# Altium schematic sheet 94330_SKYPULSE IOC_V1.3.SchDoc
size 595 x 420 mm; PageSetup: Record=PageOptions|CenterHorizontal=False|CenterVertical=False|PrintScale=0.49|XCorrection=1.00|YCorrection=1.00|PrintKind=2|BorderSize=5000000|LeftOffset=0|BottomOffset=0|Orientation=2|PaperLength=1000|PaperWidth=1000|Scale=100|PaperSource=7|PrintQuality=-3|MediaType=1|DitherType=10|PrintScaleMode=1|PaperKind= |PaperIndex=256
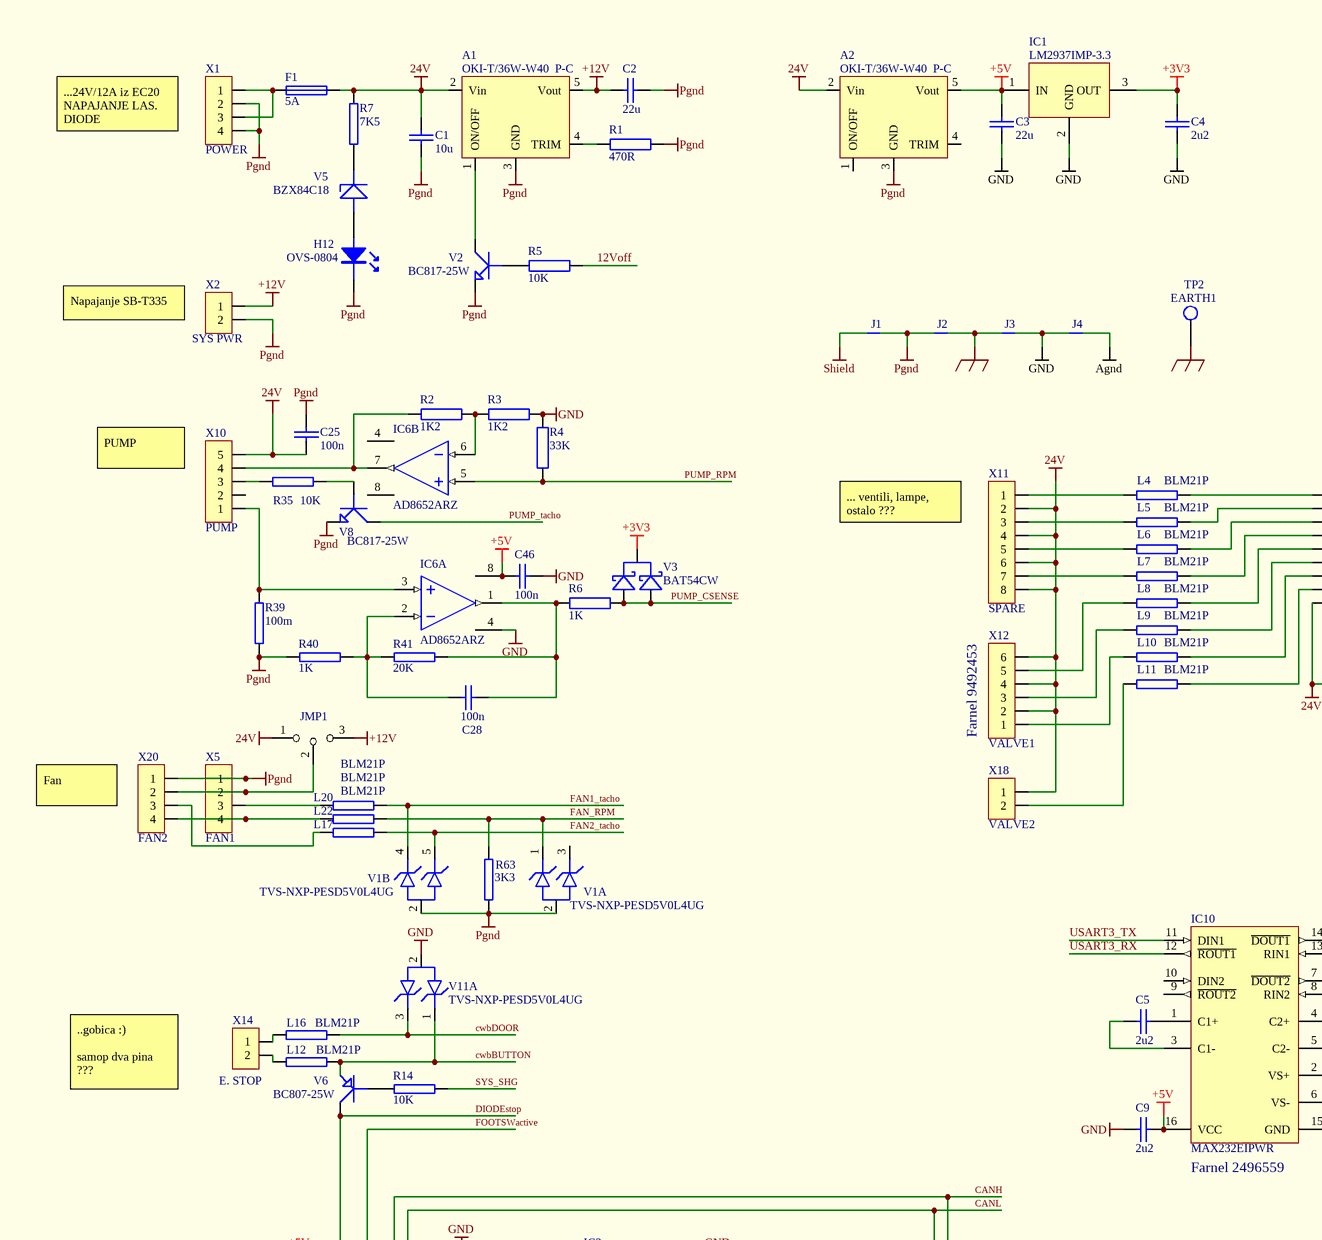
[diagram p0: 94330_SKYPULSE IOC_V1.3.SchDoc, top left]
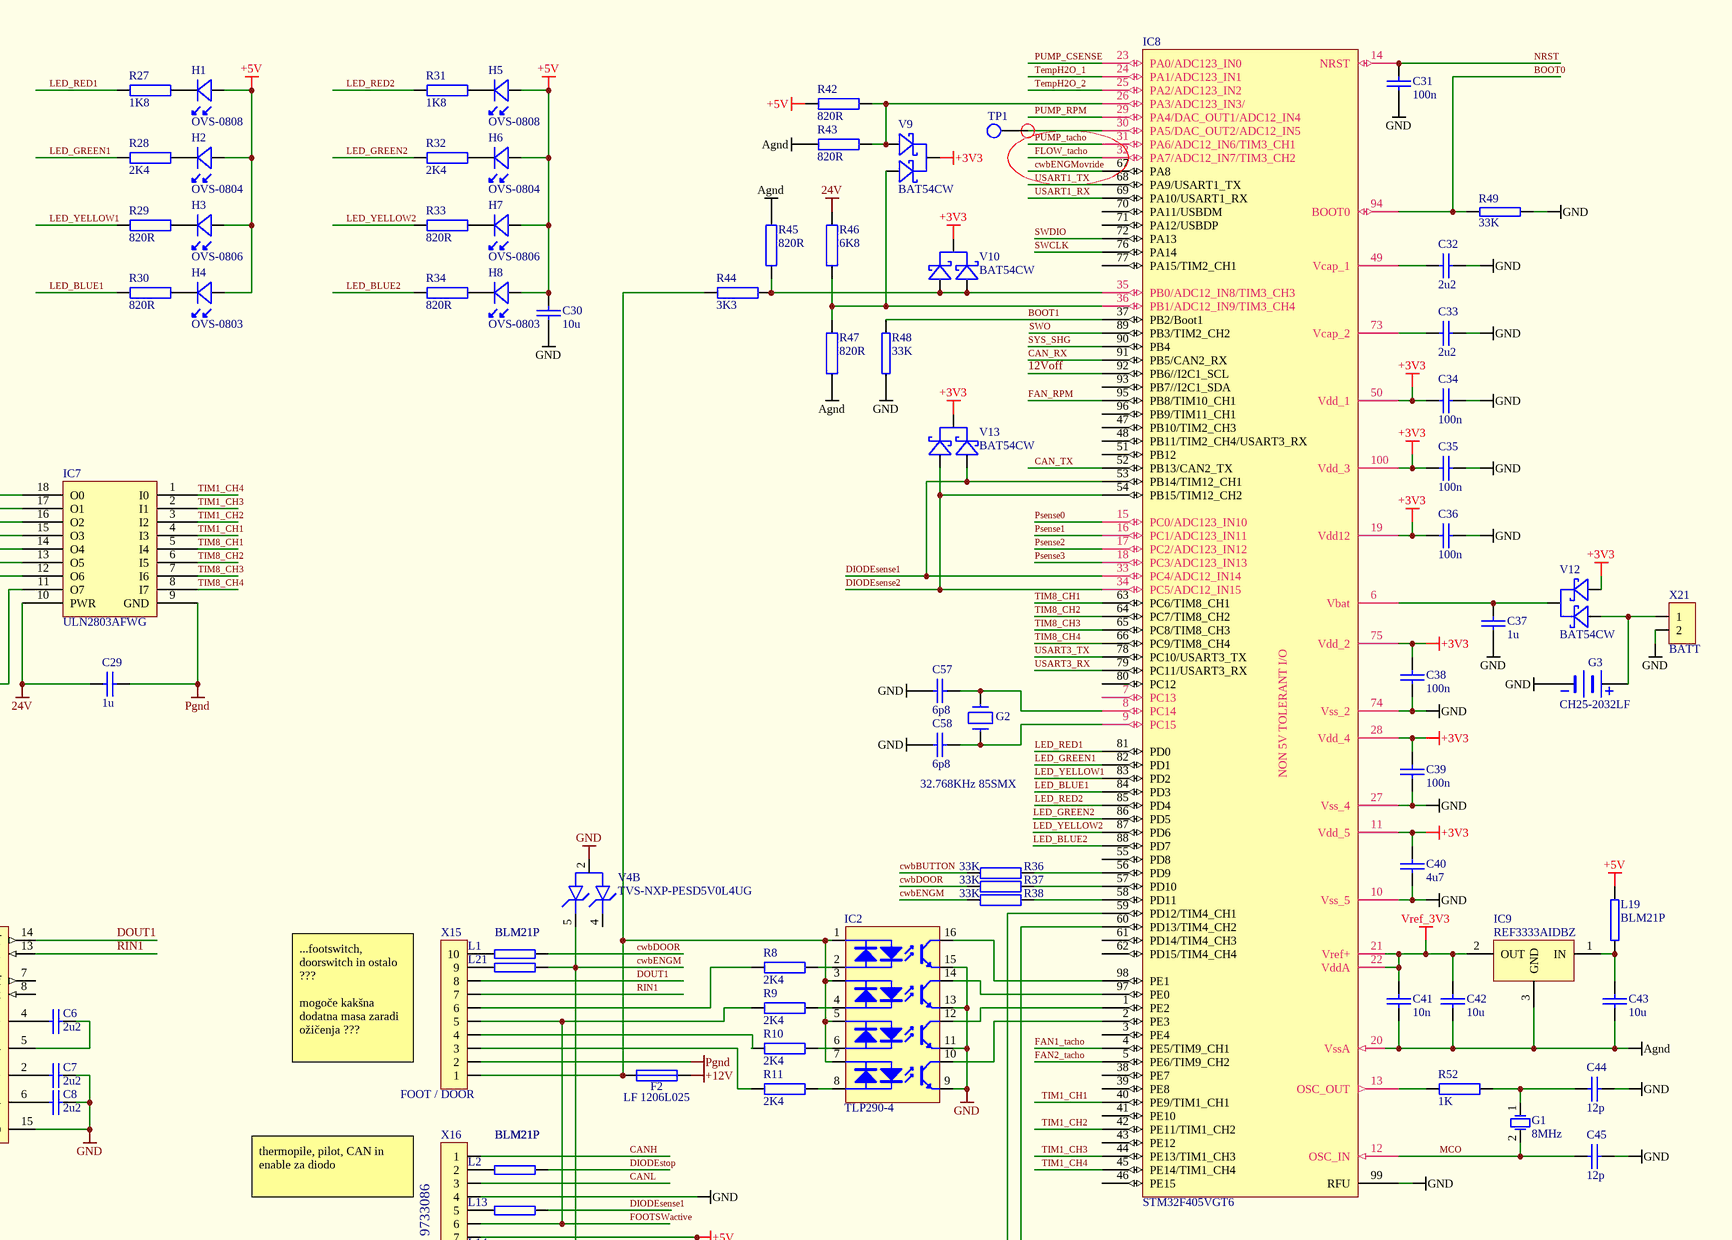
[diagram p1: 94330_SKYPULSE IOC_V1.3.SchDoc, top right]
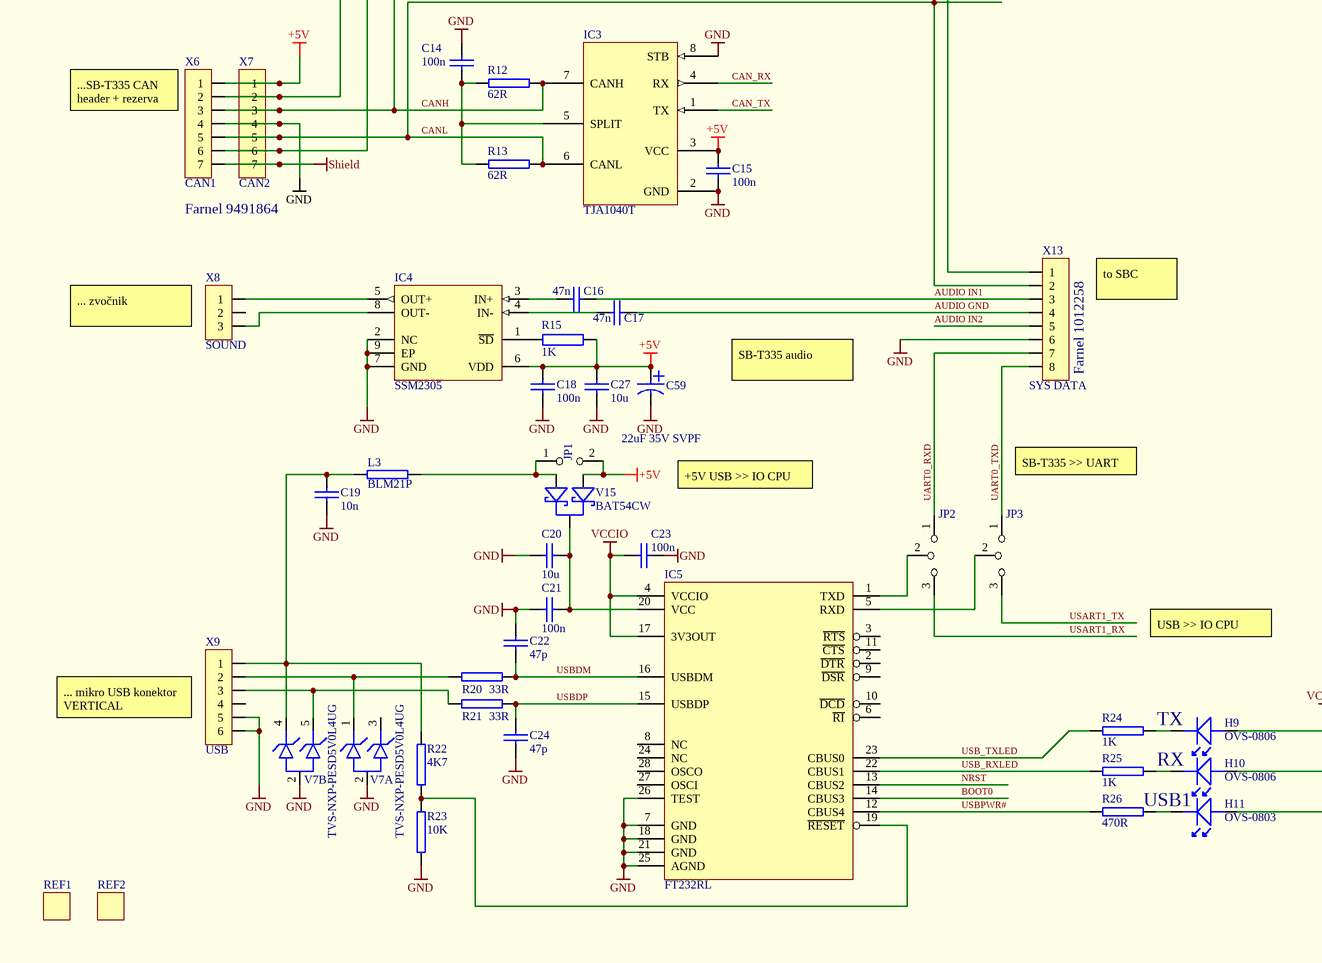
[diagram p2: 94330_SKYPULSE IOC_V1.3.SchDoc, bottom left]
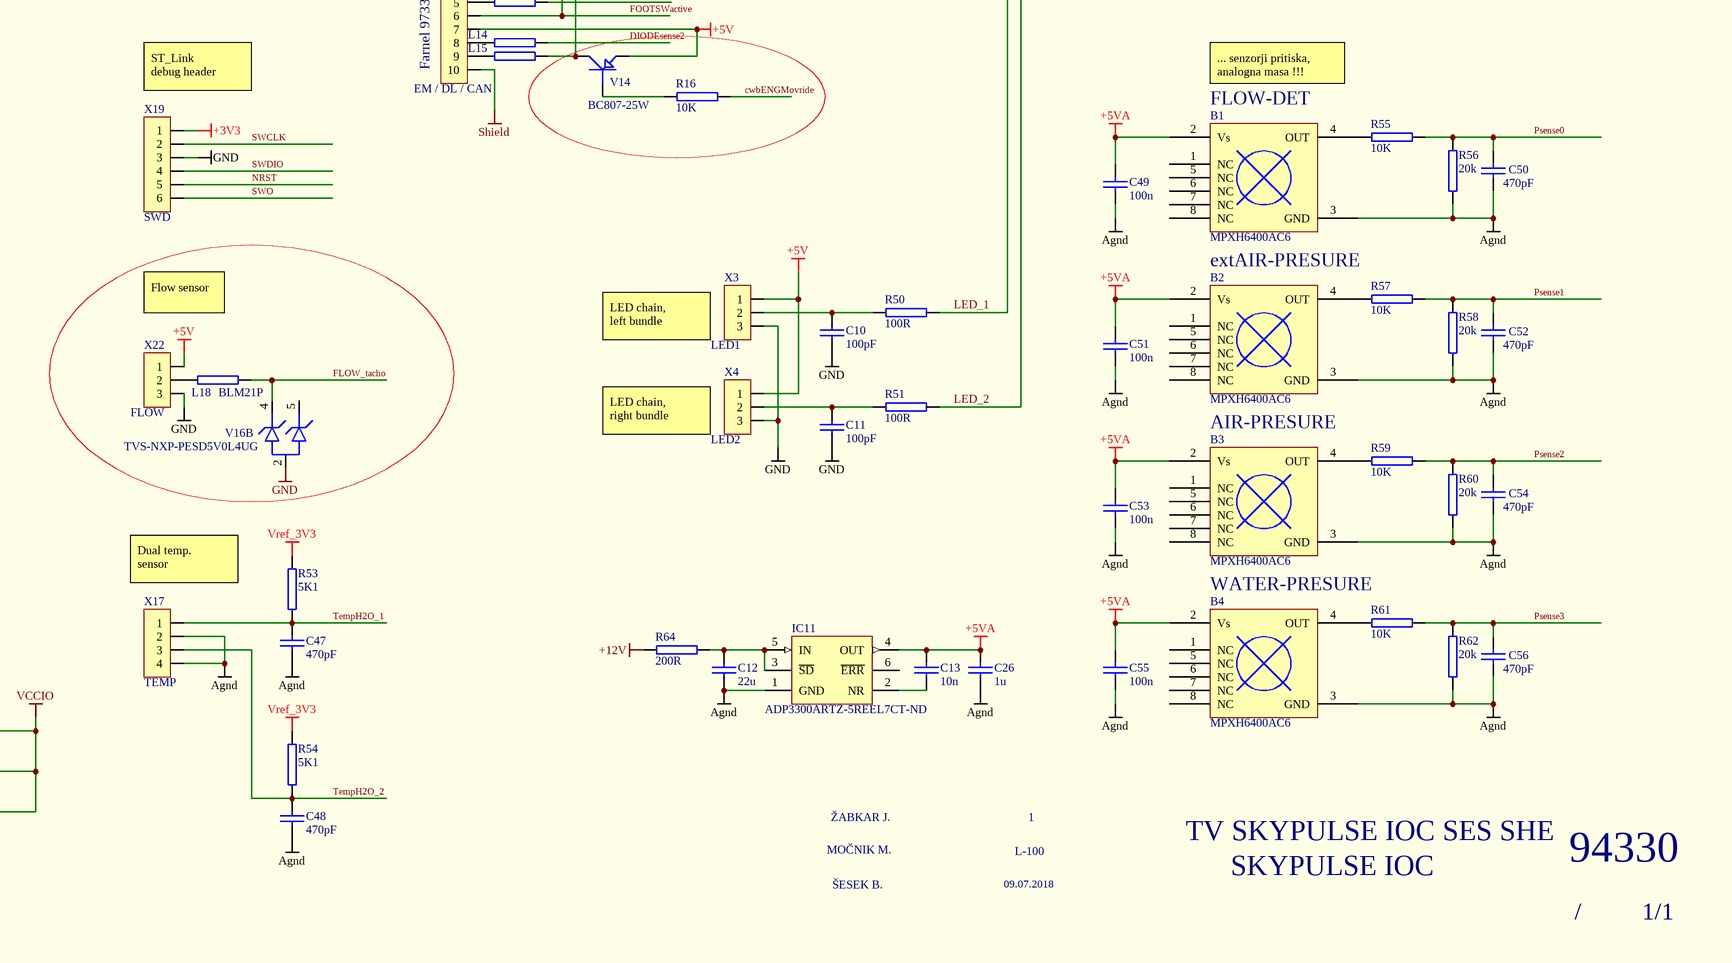
[diagram p3: 94330_SKYPULSE IOC_V1.3.SchDoc, bottom right]

## Parts
A1  OKI-T/36W-W40  P-C  [DC-DC_OKI-T/36W-W40]
A2  OKI-T/36W-W40  P-C  [DC-DC_OKI-T/36W-W40]
B1  MPXH6400AC6  [SOIC127P1030-8N_MPXH6400AC6]
B2  MPXH6400AC6  [SOIC127P1030-8N_MPXH6400AC6]
B3  MPXH6400AC6  [SOIC127P1030-8N_MPXH6400AC6]
B4  MPXH6400AC6  [SOIC127P1030-8N_MPXH6400AC6]
C1  10u  [CAPC3225N]
C2  22u  [CAPC3225N]
C3  22u  [CAPC3225N]
C4  2u2  [0805-C-IPC-V]
C5  2u2  [0805-C-IPC-V]
C6  2u2  [0805-C-IPC-V]
C7  2u2  [0805-C-IPC-V]
C8  2u2  [0805-C-IPC-V]
C9  2u2  [0805-C-IPC-V]
C10  100pF  [0805-C-IPC-V]
C11  100pF  [0805-C-IPC-V]
C12  22u  [CAPC3225N]
C13  10n  [0805-C-IPC-V]
C14  100n  [0805-C-IPC-V]
C15  100n  [0805-C-IPC-V]
C16  47n  [0805-C-IPC-V]
C17  47n  [0805-C-IPC-V]
C18  100n  [0805-C-IPC-V]
C19  10n  [0805-C-IPC-V]
C20  10u  [0805-C-IPC-V]
C21  100n  [0805-C-IPC-V]
C22  47p  [0805-C-V]
C23  100n  [0805-C-IPC-V]
C24  47p  [0805-C-V]
C25  100n  [0805-C-IPC-V]
C26  1u  [0805-C-IPC-V]
C27  10u  [0805-C-IPC-V]
C28  100n  [0805-C-IPC-V]
C29  1u  [0805-C-IPC-V]
C30  10u  [0805-C-IPC-V]
C31  100n  [0805-C-IPC-V]
C32  2u2  [0805-C-IPC-V]
C33  2u2  [0805-C-IPC-V]
C34  100n  [0805-C-IPC-V]
C35  100n  [0805-C-IPC-V]
C36  100n  [0805-C-IPC-V]
C37  1u  [0805-C-IPC-V]
C38  100n  [0805-C-IPC-V]
C39  100n  [0805-C-IPC-V]
C40  4u7  [0805-C-IPC-V]
C41  10n  [0805-C-IPC-V]
C42  10u  [0805-C-IPC-V]
C43  10u  [0805-C-IPC-V]
C44  12p  [0805-C-IPC-V]
C45  12p  [0805-C-IPC-V]
C46  100n  [0805-C-IPC-V]
C47  470pF  [0805-C-IPC-V]
C48  470pF  [0805-C-IPC-V]
C49  100n  [0805-C-IPC-V]
C50  470pF  [0805-C-IPC-V]
C51  100n  [0805-C-IPC-V]
C52  470pF  [0805-C-IPC-V]
C53  100n  [0805-C-IPC-V]
C54  470pF  [0805-C-IPC-V]
C55  100n  [0805-C-IPC-V]
C56  470pF  [0805-C-IPC-V]
C57  6p8  [0805-C-IPC-V]
C58  6p8  [0805-C-IPC-V]
C59  22uF 35V SVPF  [CAPAE66W54HN]
F1  5A  [FUSE_154_ LITTELFUSE]
F2  LF 1206L025  [FUSEC3216X09N]
G1  8MHz  [JXG53P2]
G2  32.768KHz 85SMX  [QUARTZ-85SMX]
G3  CH25-2032LF  [BATTERY HOLDER-20]
H1  OVS-0808  [LED_0805_RED]
H2  OVS-0804  [LED_0805_GREEN]
H3  OVS-0806  [LED_0805_YELLOW]
H4  OVS-0803  [LED_0805_BLUE]
H5  OVS-0808  [LED_0805_RED]
H6  OVS-0804  [LED_0805_GREEN]
H7  OVS-0806  [LED_0805_YELLOW]
H8  OVS-0803  [LED_0805_BLUE]
H9  OVS-0806  [LED_0805_YELLOW]
H10  OVS-0806  [LED_0805_YELLOW]
H11  OVS-0803  [LED_0805_BLUE]
H12  OVS-0804  [LED_0805_GREEN]
IC1  LM2937IMP-3.3  [SOT223-4N-V]
IC2  TLP290-4  [SOIC127P700X265-16N]
IC3  TJA1040T  [SO_8]
IC4  SSM2305  [SON50P300X85_HS-9N]
IC5  FT232RL  [SOP65P780-28N]
IC6  AD8652ARZ  [SOIC127P600-8N]  (parts A,B of 2)
IC7  ULN2803AFWG  [SOIC127P1030-18N]
IC8  STM32F405VGT6  [LQFP100_N]
IC9  REF3333AIDBZ  [SOT23-3N]
IC10  MAX232EIPWR  [TSOP65P640-16N]
IC11  ADP3300ARTZ-5REEL7CT-ND  [SOT23-6N]
J1  JMP-GND  [JMP-GND]  (value not drawn)
J2  JMP-GND  [JMP-GND]  (value not drawn)
J3  JMP-GND  [JMP-GND]  (value not drawn)
J4  JMP-GND  [JMP-GND]  (value not drawn)
JMP1  (no value)
JP1  (no value)  [SIP_2]
JP2  (no value)  [JMP3-SMD-1,2,3]
JP3  (no value)  [JMP3-SMD-1,2,3]
L1  BLM21P  [INDC2012N]
L2  BLM21P  [INDC2012N]
L3  BLM21P  [INDC2012N]
L4  BLM21P  [INDC2012N]
L5  BLM21P  [INDC2012N]
L6  BLM21P  [INDC2012N]
L7  BLM21P  [INDC2012N]
L8  BLM21P  [INDC2012N]
L9  BLM21P  [INDC2012N]
L10  BLM21P  [INDC2012N]
L11  BLM21P  [INDC2012N]
L12  BLM21P  [INDC2012N]
L13  BLM21P  [INDC2012N]
L14  BLM21P  [INDC2012N]
L15  BLM21P  [INDC2012N]
L16  BLM21P  [INDC2012N]
L17  BLM21P  [INDC2012N]
L18  BLM21P  [INDC2012N]
L19  BLM21P  [INDC2012N]
L20  BLM21P  [INDC2012N]
L21  BLM21P  [INDC2012N]
L22  BLM21P  [INDC2012N]
R1  470R  [0805-R-IPC-V]
R2  1K2  [0805-R-IPC-V]
R3  1K2  [0805-R-IPC-V]
R4  33K  [0805-R-V]
R5  10K  [0805-R-IPC-V]
R6  1K  [0805-R-IPC-V]
R7  7K5  [0805-R-IPC-V]
R8  2K4  [0805-R-IPC-V]
R9  2K4  [0805-R-IPC-V]
R10  2K4  [0805-R-IPC-V]
R11  2K4  [0805-R-IPC-V]
R12  62R  [0805-R-IPC-V]
R13  62R  [0805-R-IPC-V]
R14  10K  [0805-R-IPC-V]
R15  1K  [0805-R-IPC-V]
R16  10K  [0805-R-IPC-V]
R20  33R  [0805-R-IPC-V]
R21  33R  [0805-R-IPC-V]
R22  4K7  [0805-R-IPC-V]
R23  10K  [0805-R-IPC-V]
R24  1K  [0805-R-IPC-V]
R25  1K  [0805-R-IPC-V]
R26  470R  [0805-R-IPC-V]
R27  1K8  [0805-R-IPC-V]
R28  2K4  [0805-R-IPC-V]
R29  820R  [0805-R-IPC-V]
R30  820R  [0805-R-IPC-V]
R31  1K8  [0805-R-IPC-V]
R32  2K4  [0805-R-IPC-V]
R33  820R  [0805-R-IPC-V]
R34  820R  [0805-R-IPC-V]
R35  10K  [0805-R-IPC-V]
R36  33K  [0805-R-IPC-V]
R37  33K  [0805-R-IPC-V]
R38  33K  [0805-R-IPC-V]
R39  100m  [RESC3216N]
R40  1K  [0805-R-IPC-V]
R41  20K  [0805-R-IPC-V]
R42  820R  [0805-R-IPC-V]
R43  820R  [0805-R-IPC-V]
R44  3K3  [0805-R-IPC-V]
R45  820R  [0805-R-IPC-V]
R46  6K8  [0805-R-IPC-V]
R47  820R  [0805-R-IPC-V]
R48  33K  [0805-R-IPC-V]
R49  33K  [0805-R-IPC-V]
R50  100R  [0805-R-IPC-V]
R51  100R  [0805-R-IPC-V]
R52  1K  [0805-R-IPC-V]
R53  5K1  [0805-R-IPC-V]
R54  5K1  [0805-R-IPC-V]
R55  10K  [0805-R-IPC-V]
R56  20k  [0805-R-IPC-V]
R57  10K  [0805-R-IPC-V]
R58  20k  [0805-R-IPC-V]
R59  10K  [0805-R-IPC-V]
R60  20k  [0805-R-IPC-V]
R61  10K  [0805-R-IPC-V]
R62  20k  [0805-R-IPC-V]
R63  3K3  [0805-R-IPC-V]
R64  200R  [RESC3216N]
REF1  MEHAN_PART_1  [TP_REF]  (value not drawn)
REF2  (no value)  [TP_REF]
TP1  (no value)  [TP-09SQ]
TP2  EARTH1  [PAD]
V1  TVS-NXP-PESD5V0L4UG  [SC70-5]  (parts A,B of 2)
V2  BC817-25W  [SOT323-3N-CBE]
V3  BAT54CW  [SOT323-3N]
V4  TVS-NXP-PESD5V0L4UG  [SC70-5]  (part B of 2)
V5  BZX84C18  [SOT_23/D1]
V6  BC807-25W  [SOT323-3N-CBE]
V7  TVS-NXP-PESD5V0L4UG  [SC70-5]  (parts A,B of 2)
V8  BC817-25W  [SOT323-3N-CBE]
V9  BAT54CW  [SOT323-3N]
V10  BAT54CW  [SOT323-3N]
V11  TVS-NXP-PESD5V0L4UG  [SC70-5]  (part A of 2)
V12  BAT54CW  [SOT323-3N]
V13  BAT54CW  [SOT323-3N]
V14  BC807-25W  [SOT323-3N-CBE]
V15  BAT54CW  [SOT323-3N]
V16  TVS-NXP-PESD5V0L4UG  [SC70-5]  (part B of 2)
X1  POWER  [CON_4.2_4X_V]
X2  SYS PWR  [CON_3.0_2X_V_DUAL ROW]
X3  LED1  [CON-PH_3PIN_JST]
X4  LED2  [CON-PH_3PIN_JST]
X5  FAN1  [MOLEX_47053-1000]
X6  CAN1  [CON-PH_7PIN_JST]
X7  CAN2  [CON-PH_7PIN_JST]
X8  SOUND  [CON-MOLEX-53047-0310]
X9  USB  [CON_uUSB_TOP]
X10  PUMP  [CON-PH_5PIN_JST]
X11  SPARE  [CON-PH_8PIN_JST]
X12  VALVE1  [CON-PH_6PIN_JST]
X13  SYS DATA  [CON-MOLEX-53047-0810]
X14  E. STOP  [CON-PH_2PIN_JST]
X15  FOOT / DOOR  [CON-PH_10PIN_JST]
X16  EM / DL / CAN  [CON-MOLEX-53047-1010]
X17  TEMP  [CON-PH_4PIN_JST]
X18  VALVE2  [CON_3.0_2X_V_DUAL ROW]
X19  SWD  [CON-06-MALE-TH-2MM-VERTICAL]
X20  FAN2  [MOLEX_47053-1000]
X21  BATT  [CON-MOLEX-53047-0210]
X22  FLOW  [CON-PH_3PIN_JST]

## Nets
24V: A1.2(Vin) A2.2(Vin) C1.1 C25.1 C29.1 F1.2 IC7.10(PWR) JMP1.1 R7.2 R46.2 X10.5 X11.2 X11.4 X11.6 X11.8 X12.2 X12.4 X12.6 X18.1
+3V3: C4.2 C34.1 C35.1 C36.1 C38.2 C39.2 C40.2 IC1.3(OUT) IC8.11(Vdd_5) IC8.19(Vdd12) IC8.28(Vdd_4) IC8.50(Vdd_1) IC8.75(Vdd_2) IC8.100(Vdd_3) V3.3(K) V9.3(K) V10.3(K) V12.2(A2) V13.3(K) X19.1
+5V: A2.5(Vout) C3.2 C9.2 C15.2 C18.2 C27.1 C30.2 C46.1 C59.P H1.A H2.A H3.A H4.A H5.A H6.A H7.A H8.A IC1.1(IN) IC3.3(VCC) IC4.6(VDD) IC6.8(VCC) IC10.16(VCC) JP1.2 L19.2 R15.1 R42.1 V14.E V15.1(A1) X3.1 X4.1 X6.1 X7.1 X16.7 X22.1
+5VA: B1.2(Vs) B2.2(Vs) B3.2(Vs) B4.2(Vs) C13.1 C26.1 C49.1 C51.1 C53.1 C55.1 IC11.4(OUT)
+12V: A1.5(Vout) C2.2 F2.1 JMP1.3 R64.2 X2.1
Agnd: B1.3(GND) B2.3(GND) B3.3(GND) B4.3(GND) C12.2 C26.2 C41.2 C42.2 C43.2 C47.2 C48.2 C49.2 C50.2 C51.2 C52.2 C53.2 C54.2 C55.2 C56.2 IC8.20(VssA) IC9.3(GND) IC11.1(GND) J4.2 R43.1 R45.2 R47.1 R56.1 R58.1 R60.1 R62.1 X17.2 X17.4
EARTH: J2.2 J3.1 TP2.1
GND: C3.1 C4.1 C7.1 C8.1 C9.1 C10.2 C11.2 C14.1 C15.1 C18.1 C19.2 C20.2 C21.1 C22.1 C23.1 C24.2 C27.2 C30.1 C31.2 C32.2 C33.2 C34.2 C35.2 C36.2 C37.2 C38.1 C39.1 C40.1 C44.1 C45.1 C46.2 C57.2 C58.2 C59.M G3.M(-) IC1.2(GND) IC2.9(E) IC2.11(E) IC2.13(E) IC2.15(E) IC3.2(GND) IC3.8(STB) IC4.2(NC) IC4.7(GND) IC4.9(EP) IC5.7(GND) IC5.18(GND) IC5.21(GND) IC5.25(AGND) IC5.26(TEST) IC6.4(VEE) IC8.10(Vss_5) IC8.27(Vss_4) IC8.74(Vss_2) IC8.99(RFU) IC10.15(GND) J3.2 J4.1 R3.2 R4.1 R23.1 R48.1 R49.2 V4.2 V7.2 V11.2 V16.2 X3.3 X4.3 X6.4 X7.4 X9.5 X9.6 X13.6 X16.4 X19.3 X21.2 X22.3
Pgnd: A1.3(GND) A2.3(GND) C1.2 C2.1 C25.2 C29.2 H12.K IC7.9(GND) J1.2 J2.1 R1.2 R39.1 R40.1 R63.2 V1.2 V2.E V8.E X1.2 X1.4 X2.2 X5.1 X15.2 X20.1
Shield: J1.1 X6.7 X7.7 X16.10
VCCIO: C23.2 H9.A H10.A H11.A IC5.4(VCCIO) IC5.17(3V3OUT)
Vref_3V3: C41.1 C42.1 IC8.21(Vref+) IC8.22(VddA) IC9.2(OUT) R53.2 R54.2
12Voff: IC8.92(PB6//I2C1_SCL) R5.1
AUDIO GND: C17.2 X13.4
AUDIO IN1: C16.2 X13.3
AUDIO IN2: X13.5
BOOT0: IC5.14(CBUS3) IC8.94(BOOT0) R49.1
BOOT1: IC8.37(PB2/Boot1) R48.2
CAN_RX: IC3.4(RX) IC8.91(PB5/CAN2_RX)
CAN_TX: IC3.1(TX) IC8.52(PB13/CAN2_TX)
CANH: IC3.7(CANH) R12.1 X6.3 X7.3 X13.1 X16.1
CANL: IC3.6(CANL) R13.1 X6.5 X7.5 X13.2 X16.3
cwbBUTTON: L12.1 R36.1 V6.E V11.1
cwbDOOR: L1.1 L16.1 R37.1 V11.3
cwbENGM: L15.1 L21.1 R38.1 V4.5 V14.C
cwbENGMovride: IC8.67(PA8) R16.2
DIODEsense1: IC8.33(PC4/ADC12_IN14) IC8.53(PB14/TIM12_CH1) L13.1 V13.2(A2)
DIODEsense2: IC8.34(PC5/ADC12_IN15) IC8.54(PB15/TIM12_CH2) L14.1 V13.1(A1)
DIODEstop: L2.1 V6.C X6.2 X7.2
DOUT1: IC10.14(~{DOUT1}) X15.8
FAN1_tacho: IC8.4(PE5/TIM9_CH1) L20.1 V1.4
FAN2_tacho: IC8.5(PE6/TIM9_CH2) L17.1 V1.5
FAN_RPM: IC8.95(PB8/TIM10_CH1) L22.1 R63.1 V1.1
FLOW_tacho: IC8.32(PA7/ADC12_IN7/TIM3_CH2) L18.1 V16.4
FOOTSWactive: R9.1 X6.6 X7.6 X15.5 X16.6
LED_1: IC8.59(PD12/TIM4_CH1) R50.1
LED_2: IC8.60(PD13/TIM4_CH2) R51.1
LED_BLUE1: IC8.84(PD3) R30.1
LED_BLUE2: IC8.88(PD7) R34.1
LED_GREEN1: IC8.82(PD1) R28.1
LED_GREEN2: IC8.86(PD5) R32.1
LED_RED1: IC8.81(PD0) R27.1
LED_RED2: IC8.85(PD4) R31.1
LED_YELLOW1: IC8.83(PD2) R29.1
LED_YELLOW2: IC8.87(PD6) R33.1
MCO: C45.2 G1.2(OSC2) IC8.12(OSC_IN)
NRST: C31.1 IC5.13(CBUS2) IC8.14(NRST) X19.5
Psense0: C50.1 IC8.15(PC0/ADC123_IN10) R55.1 R56.2
Psense1: C52.1 IC8.16(PC1/ADC123_IN11) R57.1 R58.2
Psense2: C54.1 IC8.17(PC2/ADC123_IN12) R59.1 R60.2
Psense3: C56.1 IC8.18(PC3/ADC123_IN13) R61.1 R62.2
PUMP_CSENSE: IC8.23(PA0/ADC123_IN0) R6.2 V3.1(A1) V3.2(A2)
PUMP_RPM: IC6.5 IC8.29(PA4/DAC_OUT1/ADC12_IN4) R4.2
PUMP_tacho: IC8.31(PA6/ADC12_IN6/TIM3_CH1) V8.C
RIN1: IC10.13(RIN1) X15.7
SWCLK: IC8.76(PA14) X19.2
SWDIO: IC8.72(PA13) X19.4
SWO: IC8.89(PB3/TIM2_CH2) X19.6
SYS_SHG: IC8.90(PB4) R14.2
TempH2O_1: C47.1 IC8.24(PA1/ADC123_IN1) R53.1 X17.1
TempH2O_2: C48.1 IC8.25(PA2/ADC123_IN2) R54.1 X17.3
TIM1_CH1: IC7.4(I3) IC8.40(PE9/TIM1_CH1)
TIM1_CH2: IC7.3(I2) IC8.42(PE11/TIM1_CH2)
TIM1_CH3: IC7.2(I1) IC8.44(PE13/TIM1_CH3)
TIM1_CH4: IC7.1(I0) IC8.45(PE14/TIM1_CH4)
TIM8_CH1: IC7.5(I4) IC8.63(PC6/TIM8_CH1)
TIM8_CH2: IC7.6(I5) IC8.64(PC7/TIM8_CH2)
TIM8_CH3: IC7.7(I6) IC8.65(PC8/TIM8_CH3)
TIM8_CH4: IC7.8(I7) IC8.66(PC9/TIM8_CH4)
UART0_RXD: JP2.1 X13.7
UART0_TXD: JP3.1 X13.8
USART1_RX: IC8.69(PA10/USART1_RX) JP2.3
USART1_TX: IC8.68(PA9/USART1_TX) JP3.3
USART3_RX: IC8.79(PC11/USART3_RX) IC10.12(~{ROUT1})
USART3_TX: IC8.78(PC10/USART3_TX) IC10.11(DIN1)
USB_RXLED: IC5.22(CBUS1) R25.2
USB_TXLED: IC5.23(CBUS0) R24.2
USBDM: C22.2 IC5.16(USBDM) R20.1
USBDP: C24.1 IC5.15(USBDP) R21.1
USBPWR#: IC5.12(CBUS4) R26.2
NetA1_1: A1.1(ON/OFF) V2.C
NetA1_4: A1.4(TRIM) R1.1
NetB1_4: B1.4(OUT) R55.2
NetB2_4: B2.4(OUT) R57.2
NetB3_4: B3.4(OUT) R59.2
NetB4_4: B4.4(OUT) R61.2
NetC5_1: C5.1 IC10.1(C1+)
NetC5_2: C5.2 IC10.3(C1-)
NetC6_1: C6.1 IC10.5(C2-)
NetC6_2: C6.2 IC10.4(C2+)
NetC7_2: C7.2 IC10.2(VS+)
NetC8_2: C8.2 IC10.6(VS-)
NetC10_1: C10.1 R50.2 X3.2
NetC11_1: C11.1 R51.2 X4.2
NetC12_1: C12.1 IC11.3(~{SD}) IC11.5(IN) R64.1
NetC13_2: C13.2 IC11.2(NR)
NetC14_2: C14.2 IC3.5(SPLIT) R12.2 R13.2
NetC16_1: C16.1 IC4.3(IN+)
NetC17_1: C17.1 IC4.4(IN-)
NetC19_1: C19.1 L3.1 R22.1 V7.4 X9.1
NetC20_1: C20.1 C21.2 IC5.20(VCC) V15.3(K)
NetC28_1: C28.1 IC6.1 R6.1 R41.2
NetC28_2: C28.2 IC6.2 R40.2 R41.1
NetC32_1: C32.1 IC8.49(Vcap_1)
NetC33_1: C33.1 IC8.73(Vcap_2)
NetC37_1: C37.1 IC8.6(Vbat) V12.3(K)
NetC43_1: C43.1 IC9.1(IN) L19.1
NetC44_2: C44.2 G1.1(OSC1) R52.1
NetC57_1: C57.1 G2.1 IC8.8(PC14)
NetC58_1: C58.1 G2.2 IC8.9(PC15)
NetF1_1: F1.1 X1.1 X1.3
NetF2_2: F2.2 IC2.1(A) IC2.3(A) IC2.5(A) IC2.7(A) R44.2 X15.1
NetG3_P: G3.P(+) V12.1(A1) X21.1
NetH1_K: H1.K R27.2
NetH2_K: H2.K R28.2
NetH3_K: H3.K R29.2
NetH4_K: H4.K R30.2
NetH5_K: H5.K R31.2
NetH6_K: H6.K R32.2
NetH7_K: H7.K R33.2
NetH8_K: H8.K R34.2
NetH9_K: H9.K R24.1
NetH10_K: H10.K R25.1
NetH11_K: H11.K R26.1
NetH12_A: H12.A V5.A
NetIC2_2: IC2.2(K) R8.2
NetIC2_4: IC2.4(K) R9.2
NetIC2_6: IC2.6(K) R10.2
NetIC2_8: IC2.8(K) R11.2
NetIC2_10: IC2.10(C) IC8.2(PE3)
NetIC2_12: IC2.12(C) IC8.1(PE2)
NetIC2_14: IC2.14(C) IC8.97(PE0)
NetIC2_16: IC2.16(C) IC8.98(PE1)
NetIC4_1: IC4.1(~{SD}) R15.2
NetIC4_5: IC4.5(OUT+) X8.1
NetIC4_8: IC4.8(OUT-) X8.3
NetIC5_1: IC5.1(TXD) JP2.2
NetIC5_5: IC5.5(RXD) JP3.2
NetIC5_19: IC5.19(~{RESET}) R22.2 R23.2
NetIC6_3: IC6.3 R39.2 X10.1
NetIC6_6: IC6.6 R2.2 R3.1
NetIC6_7: IC6.7 R2.1 X10.4
NetIC7_11: IC7.11(O7) L11.1
NetIC7_12: IC7.12(O6) L10.1
NetIC7_13: IC7.13(O5) L9.1
NetIC7_14: IC7.14(O4) L8.1
NetIC7_15: IC7.15(O3) L7.1
NetIC7_16: IC7.16(O2) L6.1
NetIC7_17: IC7.17(O1) L5.1
NetIC7_18: IC7.18(O0) L4.1
NetIC8_13: IC8.13(OSC_OUT) R52.2
NetIC8_26: IC8.26(PA3/ADC123_IN3/) R42.2 R43.2 V9.2(A2)
NetIC8_30: IC8.30(PA5/DAC_OUT2/ADC12_IN5) TP1.1
NetIC8_35: IC8.35(PB0/ADC12_IN8/TIM3_CH3) R44.1 R45.1 V10.1(A1) V10.2(A2)
NetIC8_36: IC8.36(PB1/ADC12_IN9/TIM3_CH4) R46.1 R47.2 V9.1(A1)
NetIC8_56: IC8.56(PD9) R36.2
NetIC8_57: IC8.57(PD10) R37.2
NetIC8_58: IC8.58(PD11) R38.2
NetJMP1_2: JMP1.2 X5.2 X20.2
NetJP1_1: JP1.1 L3.2 V15.2(A2)
NetL1_2: L1.2 X15.10
NetL2_2: L2.2 X16.2
NetL4_2: L4.2 X11.1
NetL5_2: L5.2 X11.3
NetL6_2: L6.2 X11.5
NetL7_2: L7.2 X11.7
NetL8_2: L8.2 X12.5
NetL9_2: L9.2 X12.3
NetL10_2: L10.2 X12.1
NetL11_2: L11.2 X18.2
NetL12_2: L12.2 X14.2
NetL13_2: L13.2 X16.5
NetL14_2: L14.2 X16.8
NetL15_2: L15.2 X16.9
NetL16_2: L16.2 X14.1
NetL17_2: L17.2 X20.3
NetL18_2: L18.2 X22.2
NetL20_2: L20.2 X5.3
NetL21_2: L21.2 X15.9
NetL22_2: L22.2 X5.4 X20.4
NetR5_2: R5.2 V2.B
NetR7_1: R7.1 V5.K
NetR8_1: R8.1 X15.6
NetR10_1: R10.1 X15.4
NetR11_1: R11.1 X15.3
NetR14_1: R14.1 V6.B
NetR16_1: R16.1 V14.B
NetR20_2: R20.2 V7.1 X9.2
NetR21_2: R21.2 V7.5 X9.3
NetR35_1: R35.1 X10.3
NetR35_2: R35.2 V8.B

Not connected (* = marked no-connect by the designer): A2 1(ON/OFF) 4(TRIM); B1 1(NC) 5(NC) 6(NC) 7(NC) 8(NC); B2 1(NC) 5(NC) 6(NC) 7(NC) 8(NC); B3 1(NC) 5(NC) 6(NC) 7(NC) 8(NC); B4 1(NC) 5(NC) 6(NC) 7(NC) 8(NC); IC5 2(~{DTR}) 3(~{RTS}) 6(~{RI}) 8(NC) 9(~{DSR}) 10(~{DCD}) 11(~{CTS}) 24(NC) 27(OSCI) 28(OSCO); IC8 3(PE4) 7(PC13) 38(PE7) 39(PE8) 41(PE10) 43(PE12) 46(PE15) 47(PB10/TIM2_CH3) 48(PB11/TIM2_CH4/USART3_RX) 51(PB12) 55(PD8) 61(PD14/TIM4_CH3) 62(PD15/TIM4_CH4) 70(PA11/USBDM) 71(PA12/USBDP) 77(PA15/TIM2_CH1) 80(PC12) 93(PB7//I2C1_SDA) 96(PB9/TIM11_CH1); IC10 7(~{DOUT2}) 8(RIN2) 9(~{ROUT2}) 10(DIN2); IC11 6(~{ERR}); V1 3; V4 4; V7 3; V16 5; X8 2; X9 4; X10 2

## Notes on the sheet
- ...24V/12A iz EC20
  NAPAJANJE LAS. DIODE
- (near X2) Napajanje SB-T335
- (near X10) PUMP
- ... ventili, lampe, ostalo ???
- (near X12) Farnel 9492453
- (near X20) Fan
- ...footswitch, doorswitch in ostalo ???
  mogoče kakšna dodatna masa zaradi ožičenja ???
- ..gobica :)
  samop dva pina ???
- (near IC10) Farnel 2496559
- thermopile, pilot, CAN in enable za diodo
- (near X16) Farnel 9733086
- (near X6) ...SB-T335 CAN header + rezerva
- (near X19) ST_Link
  debug header
- (near B1) FLOW-DET
- ... senzorji pritiska, analogna masa !!!
- Farnel 9491864
- extAIR-PRESURE
- (near X8) ... zvočnik
- to SBC
- Flow sensor
- (near X3) LED chain,
  left bundle
- SB-T335 audio
- (near X13) Farnel 1012258
- SB-T335 >> UART
- (near X4) LED chain,
  right bundle
- AIR-PRESURE
- +5V USB >> IO CPU
- Dual temp.
  sensor
- WATER-PRESURE
- USB >> IO CPU
- (near X9) ... mikro USB konektor VERTICAL
- TX
- USB1
- RX
- MOČNIK M.
- ŽABKAR J.
- L-100
- 1
- TV SKYPULSE IOC SES SHE
- SKYPULSE IOC
- 94330
- ŠESEK B.
- 09.07.2018
- /
- 1/1
- 2
- 3
- 4
- 5
- 6
- 7
- 8
- 9
- 10
- 11
- 12
- A
- B
- C
- D
- E
- F
- G
- H
- Vod. projekt.
- Izdaja
- Naziv/Item
- Ident/Part No.:
- Projektiral
- Designer
- Konstruiral
- Proj. manag.
- Edition
- Št. obv.
- Modif.No.
- Datum
- Detailer
- Tehnolog
- Technol.
- Date
- Podpis
- Signed
- Arhiv/File
- Merilo/Scale
- List/Sheet
- FotonaO
- KF 04-01-14 Ver.2
- Vse pravice pridržane! / All rights reserved.
- (in symbol STM32F205VGT6) NON 5V TOLERANT I/O

## Library data of the parts
A1 A2 = MURATA_OKI-T/36W-W40  X-C: Selectable Output DC-DC Converter; 8. Oblika: SMD; 1. Naziv: DC/DC MODUL; 4. Proizvajalec: MURATA POWER SOLUTIONS; 6. Dobavitelj: MOUSER; 7. Dobavitelj koda: 580-OKI-T/36W-W40P-C; 9.a FOTONA ID:: 97233; 5. Proizvajalec koda: OKI-T/36W-W40P-C; 2. Vrednost: OKI-T/36W-W40  P-C
B1-B4 = MPXH6400A: Pressure sensor, 400kPa; 8. Oblika: SOIC127; 1. Naziv: SENZOR TLAKA; 4. Proizvajalec: NXP; 6. Dobavitelj: FARNELL; 7. Dobavitelj koda: 2102571; 5. Proizvajalec koda: MPXH6400AC6U; 9.a FOTONA ID:: 81481; 2. Vrednost: MPXH6400AC6
C1 = 22u 1210 X7R 25V 10%: KOND. 1210 10uF 50V 20% X5S; 4. Proizvajalec: TDK; 6. Dobavitelj: Farnell; 7. Dobavitelj koda: 2112729; 5. Proizvajalec koda: C3225X7S1H106M250AB; 3. Dodatni opis: SMD 1210 X7S 20%  50V; 1. Naziv: KOND.; 8. Oblika: SMD 1210; 2. Vrednost: 10u
C2 C12 = 22u 1210 X7R 25V 10%: KOND. 1210 22uF 25V 10% X5R; 4. Proizvajalec: MURATA; 6. Dobavitelj: Farnell; 7. Dobavitelj koda: 1828821; 5. Proizvajalec koda: GRM32ER61E226KE15L; 3. Dodatni opis: SMD 1210 X5R 10% 25V; 1. Naziv: KOND.; 8. Oblika: SMD 1210; 2. Vrednost: 22u
C3 = 47u 1210 X5R 6V3 10%: KOND. 1210 22uF 25V 10% X5R; 4. Proizvajalec: MURATA; 6. Dobavitelj: Farnell; 7. Dobavitelj koda: 1828821; 5. Proizvajalec koda: GRM32ER61E226KE15L; 3. Dodatni opis: SMD 1210 X5R 10% 25V; 1. Naziv: KOND.; 8. Oblika: SMD 1210; 2. Vrednost: 22u
C4-C9 = 1u 0805 X7R 50V 10%: KOND. 0805 2,2uF 25V 10% X7R; 4. Proizvajalec: MURATA; 6. Dobavitelj: Farnell; 7. Dobavitelj koda: 2688538; 5. Proizvajalec koda: GRM21BR71E225KE11L; 3. Dodatni opis: SMD 0805 X7R 10% 25V; 1. Naziv: KOND.; 8. Oblika: SMD 0805; 2. Vrednost: 2u2
C10 C11 = C: KOND. 0805 100pF 50V 5% COG; 3. Dodatni opis: SMD 0805 COG 5% 50V; 9.a FOTONA ID:: 69176; Mi Elektronika ID: 006018; 1. Naziv: KOND.; 8. Oblika: SMD 0805; 2. Vrednost: 100pF
C13 = C: KOND. 0805 10nF 10% 50V X7R; 3. Dodatni opis: SMD 0805 X7R 10% 100V; 9.a FOTONA ID:: 59327; Mi Elektronika ID: 006079; 1. Naziv: KOND.; 8. Oblika: SMD 0805; 2. Vrednost: 10n
C14 C15 C21 C23 C25 C34-C36 C38 C39 C49 C51 C53 C55 = C: KOND. 0805 100nF 50V 10% X7R; 3. Dodatni opis: SMD 0805 X7R 10% 100V; 9.a FOTONA ID:: 59327; Mi Elektronika ID: 006076; 1. Naziv: KOND.; 8. Oblika: SMD 0805; 2. Vrednost: 100n
C16 C17 = C: KOND. 0805 47nF 50V X7R 10%; 3. Dodatni opis: SMD 0805 X7R 10% 100V; 9.a FOTONA ID:: 81073; Mi Elektronika ID: 006115; 1. Naziv: KOND.; 8. Oblika: SMD 0805; 2. Vrednost: 47n
C18 = C: KOND. 0805 100nF 50V 10% X7R; 3. Dodatni opis: SMD 0805 X5R 20% 25V; Mi Elektronika ID: 006076; 1. Naziv: KOND.; 8. Oblika: SMD 0805; 2. Vrednost: 100n
C19 = C: KOND. 0805 10nF 10% 50V X7R; 3. Dodatni opis: SMD 0805 X7R 10% 100V; 9.a FOTONA ID:: 39638; Mi Elektronika ID: 006079; 1. Naziv: KOND.; 8. Oblika: SMD 0805; 2. Vrednost: 10n
C20 = CAP: KOND. 0805 10uF 10V 10% X7R; 4. Proizvajalec: TDK; 6. Dobavitelj: Farnell; 7. Dobavitelj koda: 2346934; 5. Proizvajalec koda: C2012X7R1A106K125AC; 3. Dodatni opis: SMD 0805 X7R 10% 10V; 9.a FOTONA ID:: 76490; 1. Naziv: KOND.; 8. Oblika: SMD 0805; 2. Vrednost: 10u
C22 C24 = C: KOND. 0805 47pF 50V 5% COG; 3. Dodatni opis: SMD 0805 COG 5% 50V; 9.a FOTONA ID:: 39615; 1. Naziv: KOND.; 8. Oblika: SMD 0805; 2. Vrednost: 47p
C26 C37 = C: KOND. 0805 1uF 50V 10% X7R; 3. Dodatni opis: SMD 0805 X7R 10% 25V; Mi Elektronika ID: 83438; 1. Naziv: KOND.; 8. Oblika: SMD 0805; 2. Vrednost: 1u
C27 = 22u 1210 X7R 25V 10%: KOND. 0805 10uF 10V 10% X7R; 4. Proizvajalec: TDK; 6. Dobavitelj: Farnell; 7. Dobavitelj koda: 2346934; 5. Proizvajalec koda: C2012X7R1A106K125AC; 3. Dodatni opis: SMD 0805 X7R 10% 10V; 9.a FOTONA ID:: 97229; 1. Naziv: KOND.; 8. Oblika: SMD 0805; 2. Vrednost: 10u
C28 C46 = 100n 0805 X7R 50V 10%: KOND. 0805 100nF 50V 10% X7R; 3. Dodatni opis: SMD 0805 X7R 10% 100V; 9.a FOTONA ID:: 59327; Mi Elektronika ID: 006076; 1. Naziv: KOND.; 8. Oblika: SMD 0805; 2. Vrednost: 100n
C29 = C: KOND. 0805 1uF 50V 10% X7R; 3. Dodatni opis: SMD 0805 X7R 10% 100V; Mi Elektronika ID: 83438; 1. Naziv: KOND.; 8. Oblika: SMD 0805; 2. Vrednost: 1u
C30 = 47u 1210 X5R 6V3 10%: KOND. 0805 10uF 10V 10% X7R; 4. Proizvajalec: TDK; 6. Dobavitelj: Farnell; 7. Dobavitelj koda: 2346934; 5. Proizvajalec koda: C2012X7R1A106K125AC; 3. Dodatni opis: SMD 0805 X7R 10% 10V; 9.a FOTONA ID:: 97229; 1. Naziv: KOND.; 8. Oblika: SMD 0805; 2. Vrednost: 10u
C31 = 100n 0603 X7R 50V 10%: KOND. 0805 100nF 50V 10% X7R; 3. Dodatni opis: SMD 0805 X7R 10% 100V; 9.a FOTONA ID:: 59327; Mi Elektronika ID: 006076; 1. Naziv: KOND.; 8. Oblika: SMD 0805; 2. Vrednost: 100n
C32 C33 = 2u2 0603 X5R 16V 10%: KOND. 0805 2,2uF 25V 10% X7R; 4. Proizvajalec: MURATA; 6. Dobavitelj: Farnell; 7. Dobavitelj koda: 2688538; 5. Proizvajalec koda: GRM21BR71E225KE11L; 3. Dodatni opis: SMD 0805 X7R 10% 25V; 1. Naziv: KOND.; 8. Oblika: SMD 0805; 2. Vrednost: 2u2
C40 = 4u7 0603 X5R 10V 10%: KOND. 0805 4,7uF 25V 10% X5R; 4. Proizvajalec: MURATA; 6. Dobavitelj: Farnell; 7. Dobavitelj koda: 1735529; 5. Proizvajalec koda: GRM21BR61E475KA12L; 3. Dodatni opis: SMD 0805 X5R 10% 25V; 1. Naziv: KOND.; 8. Oblika: SMD 0805; 2. Vrednost: 4u7
C41 = 10n 0603 X7R 50V 10%: KOND. 0805 10nF 10% 50V X7R; 3. Dodatni opis: SMD 0805 X7R 10% 100V; 9.a FOTONA ID:: 39638; Mi Elektronika ID: 006079; 1. Naziv: KOND.; 8. Oblika: SMD 0805; 2. Vrednost: 10n
C42 C43 = 10u 0603 X5R 6V3 10%: KOND. 0805 10uF 10V 10% X7R; 4. Proizvajalec: TDK; 6. Dobavitelj: Farnell; 7. Dobavitelj koda: 2346934; 5. Proizvajalec koda: C2012X7R1A106K125AC; 3. Dodatni opis: SMD 0805 X7R 10% 10V; 9.a FOTONA ID:: 76490; 1. Naziv: KOND.; 8. Oblika: SMD 0805; 2. Vrednost: 10u
C44 C45 = 12p 0603 C0G 50V 10%: KOND. 0805 12pF 50V 5% COG; 3. Dodatni opis: SMD 0805 COG 5% 50V; 1. Naziv: KOND.; 8. Oblika: SMD 0805; 2. Vrednost: 12p
C47 C48 C50 C52 C54 C56 = C: KOND. 0805 470P 50V 5% COG; 3. Dodatni opis: SMD 0805 COG 5% 50V; 9.a FOTONA ID:: 69176; Mi Elektronika ID: 006053; 1. Naziv: KOND.; 8. Oblika: SMD 0805; 2. Vrednost: 470pF
C57 C58 = 12p 0603 C0G 50V 10%: KOND. 0805 6,8pF 50V 5% COG; 3. Dodatni opis: SMD 0805 COG 5% 50V; 1. Naziv: KOND.; 8. Oblika: SMD 0805; 2. Vrednost: 6p8
C59 = C-EL: KONDEN. ELEK. SMD 22UF 35V; 7. Dobavitelj koda: 2354807RL; 6. Dobavitelj: Farnell; Mi Elektronika ID: 005560
F1 = FUSE: FUSE OMNI-BLOK Series 5 A; 1. Naziv: VAROVALKA; 4. Proizvajalec: LITTELFUSE; 6. Dobavitelj: Farnell; 7. Dobavitelj koda: 9943773; 5. Proizvajalec koda: 0154005.DRT; 3. Dodatni opis: 5A 125V 0154005.T; 9.a FOTONA ID:: 82937; 2. Vrednost: 5A
F2 = FUSE1: PPTC Resettable Fuse; 1. Naziv: VAROVALKA; 4. Proizvajalec: LITTELFUSE; 6. Dobavitelj: Farnell; 7. Dobavitelj koda: 1596990; 5. Proizvajalec koda: 1206L025YR; 3. Dodatni opis: SMD 1206 0.25A; 9.a FOTONA ID:: 87468; 8. Oblika: SMD 1206; 2. Vrednost: LF 1206L025
G1 = Crystal 25MHz: Crystal, 8 MHz, SMD, 5mm x 3.2mm; 8. Oblika: SMD 5x3.2mm; 6. Dobavitelj: Farnell; 7. Dobavitelj koda: 2101329RL; 1. Naziv: KRISTAL; 4. Proizvajalec: ABRACON; 5. Proizvajalec koda: ABM3-8.000MHZ-D2Y-T; 2. Vrednost: 8MHz
G2 = CRYSTAL: Crystal, 32.768 kHz, SMD; 5. Proizvajalec koda: LFXTAL003000; 4. Proizvajalec: IQD; 6. Dobavitelj: Farnell; 7. Dobavitelj koda: 9713220
G3 = BATTERY LI 3V: Li CELL 3V, 3/2 PIN, HOR/VERT POS
H1 H5 = OVS-0808: LED; 6. Dobavitelj: Farnell; 7. Dobavitelj koda: 1716768; 1. Naziv: LED DIODA; 4. Proizvajalec: Multicomp; 3. Dodatni opis: RED; 9.a FOTONA ID:: 86557; 8. Oblika: SMD 0805; 5. Proizvajalec koda: OVS-0808; 2. Vrednost: OVS-0808
H2 H6 = OVS-0804: LED; 6. Dobavitelj: Farnell; 7. Dobavitelj koda: 1716766; 1. Naziv: LED DIODA; 4. Proizvajalec: Multicomp; 3. Dodatni opis: GREEN; 9.a FOTONA ID:: 86558; 8. Oblika: SMD 0805; 5. Proizvajalec koda: OVS-0804; 2. Vrednost: OVS-0804
H3 H7 = OVS-0806: LED; 6. Dobavitelj: Farnell; 7. Dobavitelj koda: 1716767; 1. Naziv: LED DIODA; 4. Proizvajalec: Multicomp; 3. Dodatni opis: YELLOW; 9.a FOTONA ID:: 86561; 8. Oblika: SMD 0805; 5. Proizvajalec koda: OVS-0806; 2. Vrednost: OVS-0806
H4 H8 = OVS-0803: LED; 6. Dobavitelj: Farnell; 7. Dobavitelj koda: 1716765; 1. Naziv: LED DIODA; 4. Proizvajalec: Multicomp; 3. Dodatni opis: BLUE; 9.a FOTONA ID:: 86560; 8. Oblika: SMD 0805; 5. Proizvajalec koda: OVS-0803; 2. Vrednost: OVS-0803
H9 H10 = LED0805: LED; 1. Naziv: LED DIODA; 4. Proizvajalec: Multicomp; 6. Dobavitelj: Farnell; 7. Dobavitelj koda: 1716767; 3. Dodatni opis: YELLOW; 9.a FOTONA ID:: 86561; 8. Oblika: SMD 0805; 5. Proizvajalec koda: OVS-0806; 2. Vrednost: OVS-0806
H11 = LED0805: LED; 1. Naziv: LED DIODA; 4. Proizvajalec: Multicomp; 6. Dobavitelj: Farnell; 7. Dobavitelj koda: 1716765; 3. Dodatni opis: BLUE; 9.a FOTONA ID:: 86560; 8. Oblika: SMD 0805; 5. Proizvajalec koda: OVS-0803; 2. Vrednost: OVS-0803
H12 = D_LED: LED; 1. Naziv: LED DIODA; 4. Proizvajalec: Multicomp; 6. Dobavitelj: Farnell; 7. Dobavitelj koda: 1716766; 3. Dodatni opis: GREEN; 9.a FOTONA ID:: 86558; 8. Oblika: SMD 0805; 5. Proizvajalec koda: OVS-0804; 2. Vrednost: OVS-0804
IC1 = LM2937IMP-3.3: Fixed 3V3 Regulator; 1. Naziv: VEZJE INT.; 8. Oblika: SMD SOT-232-3N; 4. Proizvajalec: TEXAS INSTRUMENTS; 6. Dobavitelj: Farnell; 7. Dobavitelj koda: 2296021; 5. Proizvajalec koda: LM2937IMP-3.3/NOPB; 9.a FOTONA ID:: 87573; 2. Vrednost: LM2937IMP-3.3
IC2 = OPTOCOUPLER-QUAD: Optocoupler, Transistor Output, 4 Channel; 4. Proizvajalec: TOSHIBA; 5. Proizvajalec koda: TLP290-4(GB; 6. Dobavitelj: Farnell; 7. Dobavitelj koda: 2524306
IC3 = TJA1040: CAN Bus, Transceiver; 1. Naziv: VEZJE INT.; 8. Oblika: SMD SO-8; 4. Proizvajalec: NXP; 6. Dobavitelj: Farnell; 7. Dobavitelj koda: 2400545; 5. Proizvajalec koda: TJA1040T/CM,118; 9.a FOTONA ID:: 80870; 2. Vrednost: TJA1040T
IC4 = SSM2305: Audio Power Amplifier; 1. Naziv: VEZJE INT.; 4. Proizvajalec: ANALOG DEVICES; 5. Proizvajalec koda: SSM2305CPZ-REEL7; 6. Dobavitelj: Farnell; 7. Dobavitelj koda: 2758624RL; 8. Oblika: 8PIN LFCSP
IC5 = FT232RL: USB to Serial port converter; 1. Naziv: VEZJE INT.; 8. Oblika: SMD SSOP-28; 4. Proizvajalec: FTDI; 6. Dobavitelj: Farnell; 7. Dobavitelj koda: 1146032; 9.a FOTONA ID:: 75182; 5. Proizvajalec koda: FT232RL; 2. Vrednost: FT232RL
IC6 = AD8652ARZ: Dual CMOS RR Op Amp; 1. Naziv: VEZJE INT.; 8. Oblika: SMD SO-8; 4. Proizvajalec: ANALOG DEVICES; 6. Dobavitelj: Farnell; 7. Dobavitelj koda: 9994335; 5. Proizvajalec koda: AD8652ARZ; 2. Vrednost: AD8652ARZ
IC7 = ULN2804: Bipolar Transistor Array, Darlington, NPN; 1. Naziv: VEZJE INT.; 4. Proizvajalec: TEXAS INSTRUMENTS; 6. Dobavitelj: Farnell; 7. Dobavitelj koda: 1652419; 5. Proizvajalec koda: ULN2803ADWR; 9.a FOTONA ID:: 83190; 2. Vrednost: ULN2803AFWG
IC8 = STM32F205VGT6: STM32 ARM-based 32-bit MCU; 6. Dobavitelj: Farnell; 7. Dobavitelj koda: 2215224; 1. Naziv: VEZJE INT.; 8. Oblika: LQFP-100; 4. Proizvajalec: STMICROELECTRONICS; 5. Proizvajalec koda: STM32F405VGT6; 2. Vrednost: STM32F405VGT6
IC9 = REF3333: 3V3 Voltage Reference; 1. Naziv: VEZJE INT.; 8. Oblika: SMD SOT-23; 4. Proizvajalec: TEXAS INSTRUMENTS; 6. Dobavitelj: Farnell; 7. Dobavitelj koda: 1755085; 5. Proizvajalec koda: REF3333AIDBZT; 9.a FOTONA ID:: 88376; 2. Vrednost: REF3333AIDBZ
IC10 = CMP-0299-00572-2: Dual RS-232 Driver / Receiver; 4. Proizvajalec: TEXAS INSTRUMENTS; 6. Dobavitelj: Farnell; 7. Dobavitelj koda: 2496559; 5. Proizvajalec koda: MAX232EIPWR
IC11 = ADP3300: LDO Voltage Regulator; 4. Proizvajalec: ANALOG DEVICES; 6. Dobavitelj: Farnell; 7. Dobavitelj koda: 2727480; 5. Proizvajalec koda: ADP3300ARTZ-5REEL7
JMP1 = JMP3: JUMPER; 1. Naziv: MEHAN. PART
JP1 = JMP2: Kontaktna letev 2pina; 1. Naziv: LETVICA KONTAKTNA; 4. Proizvajalec: FISCHER ELEK.; 6. Dobavitelj: Burklin; 7. Dobavitelj koda: 59 F 670; 5. Proizvajalec koda: SL1; 9. Opomba: 2 pin; 3. Dodatni opis: KONTAKT NATIČNI SL1; 9.a FOTONA ID:: 34407
JP2 JP3 = JMP3: Kontaktna letev 3 pin; 1. Naziv: LETVICA KONTAKTNA; 4. Proizvajalec: FISCHER ELEK.; 6. Dobavitelj: Burklin; 7. Dobavitelj koda: 59 F 670; 5. Proizvajalec koda: SL1; 9. Opomba: 3 pin; 3. Dodatni opis: KONTAKT NATIČNI SL1; 9.a FOTONA ID:: 34407; 2. Vrednost: JMP3
L1-L22 = BLM21: Ferrite Bead, 0805; 1. Naziv: DUŠILKA; 4. Proizvajalec: MURATA; 6. Dobavitelj: Farnell; 7. Dobavitelj koda: 1515663; 5. Proizvajalec koda: BLM21PG331SN1D; 9.a FOTONA ID:: 90218; 8. Oblika: SMD 0805; 2. Vrednost: BLM21PG331SN1D
R1 = 2k2 1% 0805 0.125W 150V: UPOR 0805 470R 1% 0,125W; 3. Dodatni opis: SMD 0805 1% 150V; 9.a FOTONA ID:: 71547; Mi Elektronika ID: 002045; 1. Naziv: UPOR; 8. Oblika: SMD 0805; 2. Vrednost: 470R
R2 R3 = 1k2 1% 0805 0.125W 150V: UPOR 0805 1,2K 1% 0,125W; 3. Dodatni opis: SMD 0805 1% 150V; 9.a FOTONA ID:: 59356; 1. Naziv: UPOR; 2. Vrednost: 1K2; 8. Oblika: SMD 0805
R4 = 33k 1% 0805 0.125W 150V: UPOR 0805 33K 1% 0,125W; 3. Dodatni opis: SMD 0805 1% 150V; 9.a FOTONA ID:: 57352; Mi Elektronika ID: 002109; 1. Naziv: UPOR; 2. Vrednost: 33K; 8. Oblika: SMD 0805
R5 = 2k2 1% 0805 0.125W 150V: UPOR 0805 10K 1% 0,125W; 3. Dodatni opis: SMD 0805 1% 150V; 9.a FOTONA ID:: 57338; Mi Elektronika ID: 002470; 1. Naziv: UPOR; 2. Vrednost: 10K; 8. Oblika: SMD 0805
R6 = 1k 1% 0805 0.125W 150V: UPOR 0805 1K 1% 0,125W; 3. Dodatni opis: SMD 0805 1% 150V; 9.a FOTONA ID:: 57346; 1. Naziv: UPOR; 2. Vrednost: 1K; 8. Oblika: SMD 0805
R7 = R: UPOR 0805 7,5K 1% 0,125W; 3. Dodatni opis: SMD 0805 1% 150V; 9.a FOTONA ID:: 80786; 1. Naziv: UPOR; 8. Oblika: SMD 0805; 2. Vrednost: 7K5
R8-R11 = 2k2 1% 0805 0.125W 150V: UPOR 0805 2,4K 1% 0,125W; 3. Dodatni opis: SMD 0805 1% 150V; 1. Naziv: UPOR; 8. Oblika: SMD 0805; 2. Vrednost: 2K4
R12 R13 = R: UPOR 0805 62R 1% 0,125W; 3. Dodatni opis: SMD 0805 1% 150V; 1. Naziv: UPOR; 8. Oblika: SMD 0805; 2. Vrednost: 62R
R14 R16 R23 R35 R55 R57 R59 R61 = R: UPOR 0805 10K 1% 0,125W; 3. Dodatni opis: SMD 0805 1% 150V; 9.a FOTONA ID:: 57338; Mi Elektronika ID: 002470; 1. Naziv: UPOR; 8. Oblika: SMD 0805; 2. Vrednost: 10K
R15 = 10R 1% 0805 0.125W 150V: UPOR 0805 1K 1% 0,125W; 3. Dodatni opis: SMD 0805 1% 150V; 9.a FOTONA ID:: 59357; 1. Naziv: UPOR; 8. Oblika: SMD 0805; 2. Vrednost: 1K
R20 R21 = R: UPOR 0805 33R 1% 0,125W; 3. Dodatni opis: SMD 0805 1% 150V; Mi Elektronika ID: 002153; 1. Naziv: UPOR; 8. Oblika: SMD 0805; 2. Vrednost: 33R
R22 = R: UPOR 0805 4,7K 1% 0,125W; 3. Dodatni opis: SMD 0805 1% 150V; 9.a FOTONA ID:: 57341; 1. Naziv: UPOR; 8. Oblika: SMD 0805; 2. Vrednost: 4K7
R24 R25 R40 = R: UPOR 0805 1K 1% 0,125W; 3. Dodatni opis: SMD 0805 1% 150V; 9.a FOTONA ID:: 57346; 1. Naziv: UPOR; 8. Oblika: SMD 0805; 2. Vrednost: 1K
R26 = R: UPOR 0805 470R 1% 0,125W; 3. Dodatni opis: SMD 0805 1% 150V; 9.a FOTONA ID:: 71547; Mi Elektronika ID: 002045; 1. Naziv: UPOR; 8. Oblika: SMD 0805; 2. Vrednost: 470R
R27 R31 = 1k8 1% 0805 0.125W 150V: UPOR 0805 1,8K 1% 0,125W; 3. Dodatni opis: SMD 0805 1% 150V; 9.a FOTONA ID:: 59382; 1. Naziv: UPOR; 8. Oblika: SMD 0805; 2. Vrednost: 1K8
R28 R32 = 2k4 1% 0805 0.125W 150V: UPOR 0805 2,4K 1% 0,125W; 3. Dodatni opis: SMD 0805 1% 150V; 1. Naziv: UPOR; 8. Oblika: SMD 0805; 2. Vrednost: 2K4
R29 R30 R33 R34 = 820R 1% 0805 0.125W 150V: UPOR 0805 820R 1% 0,125W; 3. Dodatni opis: SMD 0805 1% 150V; 9.a FOTONA ID:: 67316; 1. Naziv: UPOR; 8. Oblika: SMD 0805; 2. Vrednost: 820R
R36-R38 = 33k 1% 0402 0.063W 50V: UPOR 0805 33K 1% 0,125W; Power: 0.063W; Voltage: 50V; Ident Fotona: 4002; Note: Comment; Validated: No; Mi Elektronika ID: 002109; Tolerance: 1%; Size: 0402; Part Number: 33k 1% 0402 0.063W 50V; Value: 33k; Manufacturer: Manufacturer; Manufacturer Part No: Manufacturer Part No
R39 = R: SMD Current Sense Resistor; 1. Naziv: UPOR; 4. Proizvajalec: BOURNS; 6. Dobavitelj: Farnell; 7. Dobavitelj koda: 1865244; 5. Proizvajalec koda: CRM1206-FX-R100ELF; 3. Dodatni opis: SMD 1206 1%; 8. Oblika: SMD 1206; 2. Vrednost: 100m
R41 R56 R58 R60 R62 = R: UPOR 0805 20K 1% 0,125W; 3. Dodatni opis: SMD 0805 1% 150V; 9.a FOTONA ID:: 57348; 1. Naziv: UPOR; 8. Oblika: SMD 0805; 2. Vrednost: 20K
R42 R43 R45 R47 = 1k8 1% 0805 0.125W 150V: UPOR 0805 820R 1% 0,125W; 3. Dodatni opis: SMD 0805 1% 150V; 9.a FOTONA ID:: 67316; 1. Naziv: UPOR; 8. Oblika: SMD 0805; 2. Vrednost: 820R
R44 = 1k8 1% 0805 0.125W 150V: UPOR 0805 3,3K 1% 0,125W; 3. Dodatni opis: SMD 0805 1% 150V; 9.a FOTONA ID:: 64663; Mi Elektronika ID: 002063; 1. Naziv: UPOR; 8. Oblika: SMD 0805; 2. Vrednost: 3K3
R46 = 1k8 1% 0805 0.125W 150V: UPOR 0805 6,8K 1% 0,125W; 3. Dodatni opis: SMD 0805 1% 150V; 9.a FOTONA ID:: 57336; 1. Naziv: UPOR; 8. Oblika: SMD 0805; 2. Vrednost: 6K8
R48 R49 = R: UPOR 0805 33K 1% 0,125W; 3. Dodatni opis: SMD 0805 1% 150V; 9.a FOTONA ID:: 57352; Mi Elektronika ID: 002109; 1. Naziv: UPOR; 8. Oblika: SMD 0805; 2. Vrednost: 33K
R50 R51 = R: UPOR 0805 100R 1% 0,125W; 3. Dodatni opis: SMD 0805 1% 150V; 9.a FOTONA ID:: 70654; Mi Elektronika ID: 002156; 1. Naziv: UPOR; 8. Oblika: SMD 0805; 2. Vrednost: 100R
R52 = 1k 1% 0603 0.1W 50V: UPOR 0805 1K 1% 0,125W; 3. Dodatni opis: SMD 0805 1% 150V; 9.a FOTONA ID:: 57346; 1. Naziv: UPOR; 8. Oblika: SMD 0805; 2. Vrednost: 1K
R53 R54 = R: UPOR 0805 5,1K 1% 0,125W; 3. Dodatni opis: SMD 0805 1% 150V; 9.a FOTONA ID:: 70654; 1. Naziv: UPOR; 8. Oblika: SMD 0805; 2. Vrednost: 5K1
R63 = R: UPOR 0805 3,3K 1% 0,125W; 3. Dodatni opis: SMD 0805 1% 150V; 9.a FOTONA ID:: 64663; Mi Elektronika ID: 002063; 1. Naziv: UPOR; 8. Oblika: SMD 0805; 2. Vrednost: 3K3
R64 = R: UPOR 1206 200R 1% 250mW; 6. Dobavitelj: Farnell; 3. Dodatni opis: SMD 1206 1%; 1. Naziv: UPOR; 8. Oblika: SMD 1206; 2. Vrednost: 200R
REF1 REF2 = MEHAN_PART_1: 1. Naziv: MEHAN. PART
  REF1: 2. Vrednost: MEHAN_PART_1
TP1 = TP
TP2 = TP: 1. Naziv: MEHAN. PART; 2. Vrednost: EARTH1
V1 V4 V7 V11 V16 = TVS-NXP-PESD3V3L4UG: TVS, NXP, PESD3V3L4UG, SOT665; 8. Oblika: SMD SC70-5; 6. Dobavitelj: Farnell; 7. Dobavitelj koda: 8737614; 1. Naziv: TVS; 4. Proizvajalec: NXP; 5. Proizvajalec koda: PESD5V0L4UG; 2. Vrednost: TVS-NXP-PESD5V0L4UG; 3. Dodatni opis: PESD5V0L4UG
V2 = BC817W: NPN Bipolar Transistor; 5. Proizvajalec koda: BC817-25W,115; 1. Naziv: TRANZISTOR; 8. Oblika: SMD SOT-323-3N; 4. Proizvajalec: NXP; 6. Dobavitelj: Farnell; 7. Dobavitelj koda: 2439011; 9.a FOTONA ID:: 86637; 2. Vrednost: BC817-25W
V3 V9 V10 V12 V13 V15 = BAT54CW: Diode Schottky Common Chatode; 1. Naziv: DIODA; 8. Oblika: SMD SOT-323-3N; 4. Proizvajalec: NXP; 6. Dobavitelj: Farnell; 7. Dobavitelj koda: 1081193; 9.a FOTONA ID:: 88971; 5. Proizvajalec koda: BAT54CW; 2. Vrednost: BAT54CW
V5 = ZD: Zener Diode SOT23; 1. Naziv: DIODA ZENER; 8. Oblika: SMD SOT-23; 9.a FOTONA ID:: 62191; 2. Vrednost: BZX84C18
V6 V14 = BC807W: PNP Bipolar Transistor; 1. Naziv: TRANZISTOR; 8. Oblika: SMD SOT-323-3N; 4. Proizvajalec: NXP; 6. Dobavitelj: Farnell; 7. Dobavitelj koda: 2439008; 5. Proizvajalec koda: BC807-25W,115; 9.a FOTONA ID:: 97206; 2. Vrednost: BC807-25W
V8 = BC817W: NPN Bipolar Transistor; 1. Naziv: TRANZISTOR; 8. Oblika: SMD SOT-323-3N; 4. Proizvajalec: NXP; 6. Dobavitelj: Farnell; 7. Dobavitelj koda: 2439011; 5. Proizvajalec koda: BC817-25W,115; 9.a FOTONA ID:: 86637; 2. Vrednost: BC817-25W
X1 = CON 4: Connector, 4.2 mm, 4 Contacts; 1. Naziv: KONEKTOR; 4. Proizvajalec: MOLEX; 6. Dobavitelj: Farnell; 7. Dobavitelj koda: 1756673; 9.a FOTONA ID:: 92258; 5. Proizvajalec koda: 39-29-3046; 2. Vrednost: POWER; 3. Dodatni opis: 39-29-3046
X2 X18 = Molex SD-35363-0260: Connector, 3 mm, 2 Contacts; 1. Naziv: KONEKTOR; 4. Proizvajalec: WURTH ELEKTRONIK; 6. Dobavitelj: Farnell; 7. Dobavitelj koda: 1641810; 5. Proizvajalec koda: 66200221122; 9.a FOTONA ID:: 86362
  X2: 2. Vrednost: SYS PWR
  X18: 2. Vrednost: VALVE2
X3 X4 X22 = CON3: Connector, 2 mm, 3 Contacts; 1. Naziv: KONEKTOR; 4. Proizvajalec: JST; 6. Dobavitelj: Farnell; 7. Dobavitelj koda: 9492429; 5. Proizvajalec koda: B3B-PH-K-S(LF)(SN); 9.a FOTONA ID:: 90115
  X3: 2. Vrednost: LED1
  X4: 2. Vrednost: LED2
  X22: 2. Vrednost: FLOW
X5 X20 = CON 4: Connector, 2.54 mm, 4 Contacts; 1. Naziv: KONEKTOR; 4. Proizvajalec: MOLEX; 6. Dobavitelj: Farnell; 7. Dobavitelj koda: 2313705; 5. Proizvajalec koda: 47053-1000; 9.a FOTONA ID:: 93895; 3. Dodatni opis: 47053-1000
  X5: 2. Vrednost: FAN1
  X20: 2. Vrednost: FAN2
X6 X7 = CON7: Connector, 2 mm, 7 Contacts; 1. Naziv: KONEKTOR; 4. Proizvajalec: JST; 5. Proizvajalec koda: B7B-PH-K-S(LF)(SN); 6. Dobavitelj: Farnell; 7. Dobavitelj koda: 9491864; 9.a FOTONA ID: 90119
X8 = CON3: Connector, 1.25 mm, 3 Contacts; 1. Naziv: KONEKTOR; 4. Proizvajalec: MOLEX; 6. Dobavitelj: Farnell; 7. Dobavitelj koda: 9732853; 5. Proizvajalec koda: 53047-0310; 2. Vrednost: SOUND
X9 = Wurth 629 105 136 821: Connector, Micro USB Type B; 1. Naziv: KONEKTOR; 4. Proizvajalec: GCT; 6. Dobavitelj: Farnell; 7. Dobavitelj koda: 2443141; 5. Proizvajalec koda: USB3145-30-1-A; 2. Vrednost: USB
X10 = CON 5: Connector, 2 mm, 5 Contacts; 1. Naziv: KONEKTOR; 4. Proizvajalec: JST; 6. Dobavitelj: Farnell; 7. Dobavitelj koda: 9492445; 5. Proizvajalec koda: B5B-PH-K-S(LF)(SN); 9.a FOTONA ID:: 90118; 2. Vrednost: PUMP
X11 = CON 8: Connector, 2 mm, 8 Contacts; 1. Naziv: KONEKTOR; 4. Proizvajalec: JST; 6. Dobavitelj: Farnell; 7. Dobavitelj koda: 9492461; 5. Proizvajalec koda: B8B-PH-K-S(LF)(SN); 9.a FOTONA ID:: 90120; 2. Vrednost: SPARE
X12 = CON 6: Connector, 2 mm, 6 Contacts; 1. Naziv: KONEKTOR; 4. Proizvajalec: JST; 5. Proizvajalec koda: B6B-PH-K-S(LF)(SN); 6. Dobavitelj: Farnell; 7. Dobavitelj koda: 9492453
X13 = CON 8: Connector, 1.25 mm, 8 Contacts; 1. Naziv: KONEKTOR; 4. Proizvajalec: MOLEX; 6. Dobavitelj: Farnell; 7. Dobavitelj koda: 1012258; 5. Proizvajalec koda: 53047-0810; 2. Vrednost: SYS DATA
X14 = JST S2B-ZR-SM4A-TF: Connector, 2 mm, 2 Contacts; 1. Naziv: KONEKTOR; 4. Proizvajalec: JST; 6. Dobavitelj: Farnell; 7. Dobavitelj koda: 9491856; 5. Proizvajalec koda: B2B-PH-K-S(LF)(SN); 9.a FOTONA ID:: 89540; 2. Vrednost: E. STOP
X15 = CON 10: Connector, 2 mm, 10 Contacts; 1. Naziv: KONEKTOR; 4. Proizvajalec: JST; 6. Dobavitelj: Farnell; 7. Dobavitelj koda: 9491880; 5. Proizvajalec koda: B10B-PH-K-S(LF)(SN); 9.a FOTONA ID:: 90121; 2. Vrednost: FOOT / DOOR
X16 = CON 10: Connector, 1.25 mm, 10 Contacts; 1. Naziv: KONEKTOR; 4. Proizvajalec: MOLEX; 6. Dobavitelj: Farnell; 7. Dobavitelj koda: 9733086; 5. Proizvajalec koda: 53047-1010; 2. Vrednost: EM / DL / CAN
X17 = CON 4: Connector, 2 mm, 4 Contacts; 1. Naziv: KONEKTOR; 4. Proizvajalec: JST; 6. Dobavitelj: Farnell; 7. Dobavitelj koda: 9492437; 5. Proizvajalec koda: B4B-PH-K-S(LF)(SN); 9.a FOTONA ID:: 90116; 2. Vrednost: TEMP
X19 = 100mil Header 1x6: Connector, 2 mm, 6 Contacts; 4. Proizvajalec: AMPHENOL; 5. Proizvajalec koda: 10075025-G01-06LF; 6. Dobavitelj: Farnell; 7. Dobavitelj koda: 1568594
X21 = JST S2B-ZR-SM4A-TF: Connector, 1.25 mm, 2 Contacts; 1. Naziv: KONEKTOR; 4. Proizvajalec: MOLEX; 6. Dobavitelj: Farnell; 7. Dobavitelj koda: 9733051; 5. Proizvajalec koda: 53047-0210; 2. Vrednost: BATT